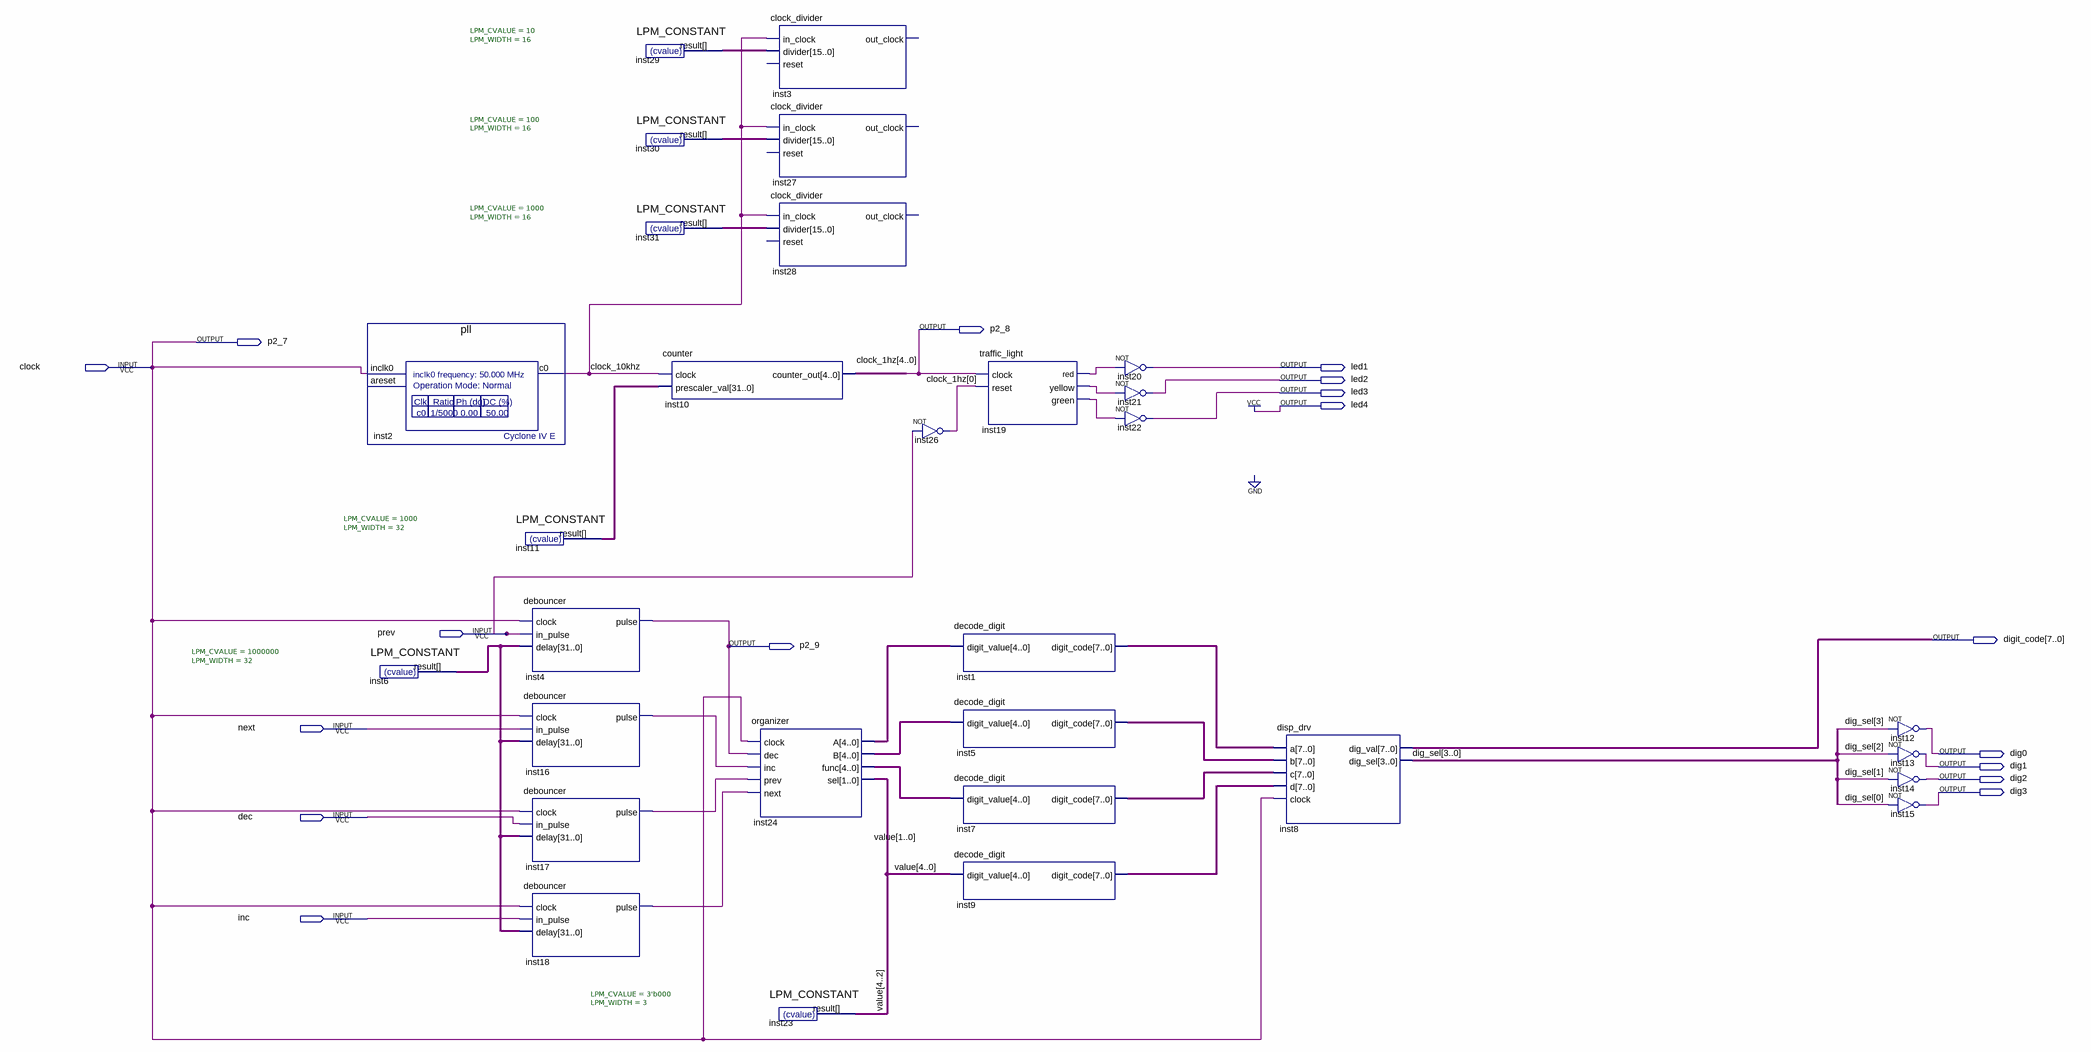
[diagram p0: schematic sheet]
// Quartus schematic alu.bdf as structural Verilog: 30 symbols, 17 pins
module alu (
  input  clock,
  input  prev,
  input  next,
  input  dec,
  input  inc,
  output p2_8,
  output p2_7,
  output led1,
  output led2,
  output led3,
  output led4,
  output [7:0] digit_code,
  output p2_9,
  output dig0,
  output dig1,
  output dig2,
  output dig3
);

  wire clock_10khz, inst16_pulse, inst17_pulse, inst18_pulse, inst19_green, inst19_red, inst19_yellow,
       inst26_out;
  wire [3:0] dig_sel;
  wire [4:0] inst24_a, inst24_b, inst24_func, value;
  wire [4:1] clock_1hz;
  wire [7:0] inst1_digit_code, inst5_digit_code, inst7_digit_code, inst9_digit_code;
  wire [15:0] inst29_result, inst30_result, inst31_result;
  wire [31:0] inst6_result, inst11_result;

  pll inst2 (.inclk0(clock), .c0(clock_10khz));  // open: areset
  LPM_CONSTANT #(.LPM_CVALUE(1000000), .LPM_WIDTH(32)) inst6 (.result(inst6_result));
  LPM_CONSTANT #(.LPM_CVALUE(1000), .LPM_WIDTH(32)) inst11 (.result(inst11_result));
  debouncer inst4 (.clock(clock), .in_pulse(prev), .delay(inst6_result), .pulse(p2_9));
  debouncer inst16 (.clock(clock), .in_pulse(next), .delay(inst6_result), .pulse(inst16_pulse));
  debouncer inst17 (.clock(clock), .in_pulse(dec), .delay(inst6_result), .pulse(inst17_pulse));
  debouncer inst18 (.clock(clock), .in_pulse(inc), .delay(inst6_result), .pulse(inst18_pulse));
  LPM_CONSTANT #(.LPM_CVALUE(10), .LPM_WIDTH(16)) inst29 (.result(inst29_result));
  LPM_CONSTANT #(.LPM_CVALUE(100), .LPM_WIDTH(16)) inst30 (.result(inst30_result));
  LPM_CONSTANT #(.LPM_CVALUE(1000), .LPM_WIDTH(16)) inst31 (.result(inst31_result));
  counter inst10 (.clock(clock_10khz), .prescaler_val(inst11_result), .counter_out({clock_1hz, p2_8}));
  organizer inst24 (
    .clock(clock), .dec(p2_9), .inc(inst16_pulse), .prev(inst17_pulse), .next(inst18_pulse), .A(inst24_a),
    .B(inst24_b), .func(inst24_func), .sel(value[1:0]));
  clock_divider inst3 (.in_clock(clock_10khz), .divider(inst29_result));  // open: reset, out_clock
  clock_divider inst27 (.in_clock(clock_10khz), .divider(inst30_result));  // open: reset, out_clock
  clock_divider inst28 (.in_clock(clock_10khz), .divider(inst31_result));  // open: reset, out_clock
  LPM_CONSTANT #(.LPM_CVALUE(3'b000), .LPM_WIDTH(3)) inst23 (.result(value[4:2]));
  not inst26 (inst26_out, prev);
  decode_digit inst1 (.digit_value(inst24_a), .digit_code(inst1_digit_code));
  decode_digit inst5 (.digit_value(inst24_b), .digit_code(inst5_digit_code));
  decode_digit inst7 (.digit_value(inst24_func), .digit_code(inst7_digit_code));
  decode_digit inst9 (.digit_value(value), .digit_code(inst9_digit_code));
  traffic_light inst19 (
    .clock(p2_8), .reset(inst26_out), .red(inst19_red), .yellow(inst19_yellow), .green(inst19_green));
  not inst20 (led1, inst19_red);
  not inst21 (led2, inst19_yellow);
  not inst22 (led3, inst19_green);
  disp_drv inst8 (
    .a(inst1_digit_code), .b(inst5_digit_code), .c(inst7_digit_code), .d(inst9_digit_code), .clock(clock),
    .dig_val(digit_code), .dig_sel(dig_sel));
  not inst12 (dig0, dig_sel[3]);
  not inst13 (dig1, dig_sel[2]);
  not inst14 (dig2, dig_sel[1]);
  not inst15 (dig3, dig_sel[0]);

  assign led4 = 1'b1;
  assign p2_7 = clock;

  // Other names for the same wires on the sheet: clock_1hz[0] = p2_8
endmodule
